# EAGLE design design (EAGLE 9.6.0)
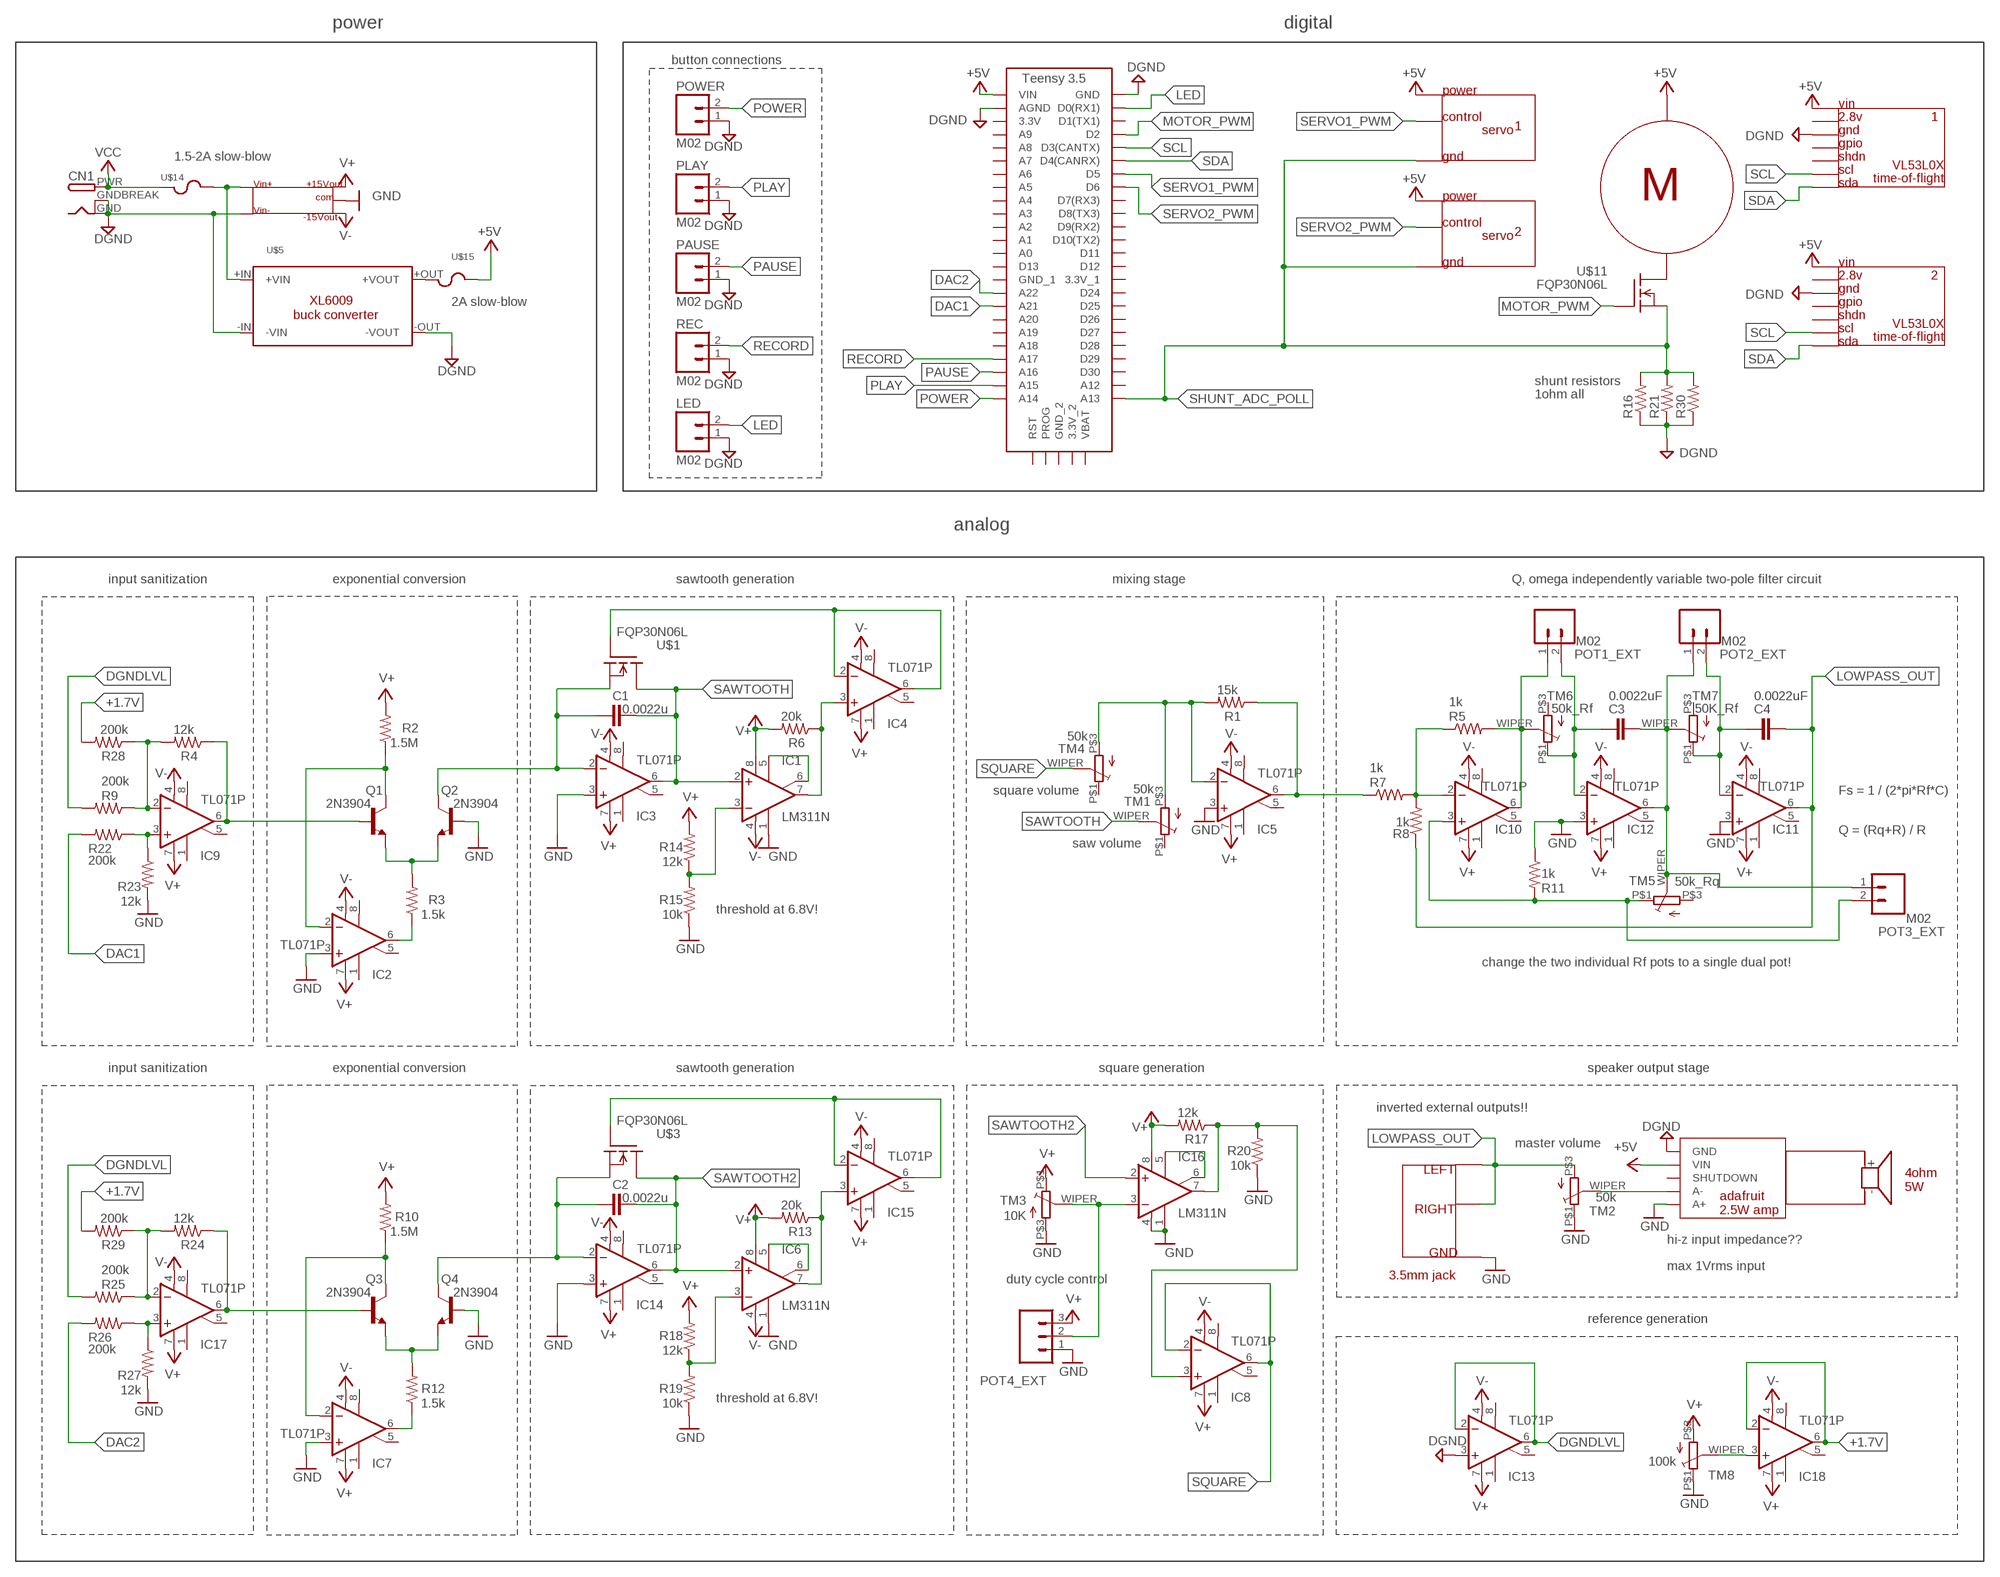
[diagram p0: schematic, sheet 1]

## Parts
C1  0.0022u  CAPPTH1  [CAP-PTH-5MM]
C2  0.0022u  CAPPTH1  [CAP-PTH-5MM]
C3  0.0022uF  CAPPTH1  [CAP-PTH-5MM]
C4  0.0022uF  CAPPTH1  [CAP-PTH-5MM]
CN1  DCBARRELPTH  [DCJACK_2MM_PTH]
IC1  LM311N  [DIL08]
IC2  TL071P  [DIL08]
IC3  TL071P  [DIL08]
IC4  TL071P  [DIL08]
IC5  TL071P  [DIL08]
IC6  LM311N  [DIL08]
IC7  TL071P  [DIL08]
IC8  TL071P  [DIL08]
IC9  TL071P  [DIL08]
IC10  TL071P  [DIL08]
IC11  TL071P  [DIL08]
IC12  TL071P  [DIL08]
IC13  TL071P  [DIL08]
IC14  TL071P  [DIL08]
IC15  TL071P  [DIL08]
IC16  LM311N  [DIL08]
IC17  TL071P  [DIL08]
IC18  TL071P  [DIL08]
LED  M02  [1X02]
PAUSE  M02  [1X02]
PLAY  M02  [1X02]
POT1_EXT  M02  [1X02]
POT2_EXT  M02  [1X02]
POT3_EXT  M02  [1X02]
POT4_EXT  M03  [1X03]
POWER  M02  [1X02]
Q1  2N3904  [TO92]
Q2  2N3904  [TO92]
Q3  2N3904  [TO92]
Q4  2N3904  [TO92]
R1  15k  RESISTORAXIAL-0.3  [AXIAL-0.3]
R2  1.5M  RESISTORAXIAL-0.3  [AXIAL-0.3]
R3  1.5k  RESISTORAXIAL-0.3  [AXIAL-0.3]
R4  12k  RESISTORAXIAL-0.3  [AXIAL-0.3]
R5  1k  RESISTORAXIAL-0.3  [AXIAL-0.3]
R6  20k  RESISTORAXIAL-0.3  [AXIAL-0.3]
R7  1k  RESISTORAXIAL-0.3  [AXIAL-0.3]
R8  1k  RESISTORAXIAL-0.3  [AXIAL-0.3]
R9  200k  RESISTORAXIAL-0.3  [AXIAL-0.3]
R10  1.5M  RESISTORAXIAL-0.3  [AXIAL-0.3]
R11  1k  RESISTORAXIAL-0.3  [AXIAL-0.3]
R12  1.5k  RESISTORAXIAL-0.3  [AXIAL-0.3]
R13  20k  RESISTORAXIAL-0.3  [AXIAL-0.3]
R14  12k  RESISTORAXIAL-0.3  [AXIAL-0.3]
R15  10k  RESISTORAXIAL-0.3  [AXIAL-0.3]
R16  RESISTORAXIAL-0.3  [AXIAL-0.3]
R17  12k  RESISTORAXIAL-0.3  [AXIAL-0.3]
R18  12k  RESISTORAXIAL-0.3  [AXIAL-0.3]
R19  10k  RESISTORAXIAL-0.3  [AXIAL-0.3]
R20  10k  RESISTORAXIAL-0.3  [AXIAL-0.3]
R21  RESISTORAXIAL-0.3  [AXIAL-0.3]
R22  200k  RESISTORAXIAL-0.3  [AXIAL-0.3]
R23  12k  RESISTORAXIAL-0.3  [AXIAL-0.3]
R24  12k  RESISTORAXIAL-0.3  [AXIAL-0.3]
R25  200k  RESISTORAXIAL-0.3  [AXIAL-0.3]
R26  200k  RESISTORAXIAL-0.3  [AXIAL-0.3]
R27  12k  RESISTORAXIAL-0.3  [AXIAL-0.3]
R28  200k  RESISTORAXIAL-0.3  [AXIAL-0.3]
R29  200k  RESISTORAXIAL-0.3  [AXIAL-0.3]
R30  RESISTORAXIAL-0.3  [AXIAL-0.3]
REC  M02  [1X02]
SP1  BUZZER  (no package)
TM1  50k  TRIMPOT  [3386_TRI]
TM2  50k  TRIMPOT  [3386_TRI]
TM3  10K  TRIMPOT  [3386_TRI]
TM4  50k  TRIMPOT  [3386_TRI]
TM5  50k_Rq  TRIMPOT  [3386_TRI]
TM6  50k_Rf  TRIMPOT  [3386_TRI]
TM7  50K_Rf  TRIMPOT  [3386_TRI]
TM8  100k  TRIMPOT  [3386_TRI]
U$1  FQP30N06L  [TO-220]
U$2  PAM8302A_ADAFRUIT  [PAM8302A_ADAFRUIT]
U$3  FQP30N06L  [TO-220]
U$4  TEENSY_3.5_EXT  [TEENSY_3.5_EXT]
U$5  DC/DC-STEP-DOWN-XL6009  [DC/DC-STEP-UP-XL6009]
U$6  3.5MM_AUDIO_JACK  [3.5MM_AUDIO_JACK]
U$7  +/-15V_BOOST_CONVERTER  [+/-15V_BOOST_CONVERTER]
U$8  SERVO_3PIN_HEADER  [SERVO_3PIN_HEADER]
U$9  SERVO_3PIN_HEADER  [SERVO_3PIN_HEADER]
U$10  3872_MOTOR  [3872_MOTOR]
U$11  FQP30N06L  [TO-220]
U$12  VL53L0X  [VL53L0X]
U$13  VL53L0X  [VL53L0X]
U$14  FUSE_5X20MM  [0751.0110]
U$15  FUSE_5X20MM  [0751.0110]

## Nets
+1.7V: IC18.2(-IN) IC18.6(OUT) R28.P$2 R29.P$2
+5V: U$2.VIN U$4.VIN U$8.POWER U$9.POWER U$10.+ U$12.VIN U$13.VIN U$15.R1 U$15.R2
BANDPASS_OUT: C3.1 IC12.6(OUT) POT2_EXT.1 POT3_EXT.1 TM5.WIPER(S) TM7.WIPER(S)
COMP_SQ_OUT: IC8.3(+IN) IC16.7(OUT) R17.P$1 R20.P$2
DAC1: R22.P$2 U$4.A21
DAC2: R26.P$2 U$4.A22
DGND: CN1.GND CN1.GNDBREAK IC13.3(+IN) LED.1 PAUSE.1 PLAY.1 POWER.1 R16.P$1 R21.P$1 R30.P$1 REC.1 U$2.GND U$4.AGND U$4.GND U$5.-IN(-VIN) U$5.-OUT(-VOUT) U$7.1 U$12.GND U$13.GND
DGNDLVL: IC13.2(-IN) IC13.6(OUT) R9.P$2 R25.P$2
GND: IC1.1(GND) IC2.3(+IN) IC3.3(+IN) IC5.3(+IN) IC6.1(GND) IC7.3(+IN) IC11.3(+IN) IC12.3(+IN) IC14.3(+IN) IC16.1(GND) IC16.4(V-) POT4_EXT.1 Q2.2(B) Q4.2(B) R11.P$1 R15.P$1 R19.P$1 R20.P$1 R23.P$2 R27.P$2 TM2.P$1(E) TM3.P$3(A) TM8.P$1(E) U$2.A+ U$6.GND U$7.7
HIGHPASS_OUT: IC10.6(OUT) POT1_EXT.1 R5.P$2 TM6.WIPER(S)
INPUT2: IC5.6(OUT) R1.P$1 R7.P$1
LED: LED.2 U$4.D0(RX1)
LOWPASS_OUT: C4.1 IC11.6(OUT) R8.P$1 TM2.P$3(A) U$6.L U$6.R
MOTOR_PWM: U$4.D2 U$11.1(G)
N$1: TM2.WIPER(S) U$2.A-
N$2: Q1.3(E) Q2.3(E) R3.P$2
N$3: Q3.3(E) Q4.3(E) R12.P$2
N$4: IC18.3(+IN) TM8.WIPER(S)
N$5: IC2.6(OUT) R3.P$1
N$6: IC1.7(OUT) IC4.3(+IN) R6.P$1
N$7: C1.1 IC3.2(-IN) Q2.1(C) U$1.3(S)
N$8: IC6.7(OUT) IC15.3(+IN) R13.P$1
N$9: IC1.5(ON) IC1.6(ON/STR)
N$10: IC4.2(-IN) IC4.6(OUT) U$1.1(G)
N$11: IC17.3(+IN) R26.P$1 R27.P$1
N$12: IC2.2(-IN) Q1.1(C) R2.P$1
N$13: IC7.6(OUT) R12.P$1
N$14: C2.1 IC14.2(-IN) Q4.1(C) U$3.3(S)
N$15: IC6.5(ON) IC6.6(ON/STR)
N$16: IC15.2(-IN) IC15.6(OUT) U$3.1(G)
N$17: IC16.5(ON) IC16.6(ON/STR)
N$18: IC10.2(-IN) R5.P$1 R7.P$2 R8.P$2
N$19: IC17.6(OUT) Q3.2(B) R24.P$1
N$20: C3.2 IC12.2(-IN) POT1_EXT.2 TM6.P$1(E)
N$21: IC7.2(-IN) Q3.1(C) R10.P$1
N$22: C4.2 IC11.2(-IN) POT2_EXT.2 TM7.P$1(E)
N$23: IC6.3(-IN) R18.P$1 R19.P$2
N$24: IC1.3(-IN) R14.P$1 R15.P$2
N$25: IC10.3(+IN) POT3_EXT.2 R11.P$2 TM5.P$1(E)
N$26: IC16.3(-IN) POT4_EXT.2 TM3.WIPER(S)
N$27: IC17.2(-IN) R24.P$2 R25.P$1 R29.P$1
N$28: IC5.2(-IN) R1.P$2 TM1.P$3(A) TM4.P$3(A)
N$29: U$5.+IN(+VIN) U$7.2 U$14.R1 U$14.R2
N$30: IC9.2(-IN) R4.P$2 R9.P$1 R28.P$1
N$31: IC9.3(+IN) R22.P$1 R23.P$1
N$32: U$5.+OUT(+VOUT) U$15.L1 U$15.L2
N$33: U$10.- U$11.2(D)
PAUSE: PAUSE.2 U$4.A16
PLAY: PLAY.2 U$4.A15
POWER: POWER.2 U$4.A14
RECORD: REC.2 U$4.A17
SAWTOOTH: C1.2 IC1.2(+IN) IC3.6(OUT) TM1.WIPER(S) U$1.2(D)
SAWTOOTH2: C2.2 IC6.2(+IN) IC14.6(OUT) IC16.2(+IN) U$3.2(D)
SCL: U$4.D3(CANTX) U$12.SCL U$13.SCL
SDA: U$4.D4(CANRX) U$12.SDA U$13.SDA
SERVO1_PWM: U$4.D5 U$8.CONTROL
SERVO2_PWM: U$4.D6 U$9.CONTROL
SHUNT_ADC_POLL: R16.P$2 R21.P$2 R30.P$2 U$4.A13 U$8.GND U$9.GND U$11.3(S)
SIGNAL1: IC9.6(OUT) Q1.2(B) R4.P$1
SQUARE: IC8.2(-IN) IC8.6(OUT) TM4.WIPER(S)
V+: IC1.8(V+) IC2.7(V+) IC3.7(V+) IC4.7(V+) IC5.7(V+) IC6.8(V+) IC7.7(V+) IC8.7(V+) IC9.7(V+) IC10.7(V+) IC11.7(V+) IC12.7(V+) IC13.7(V+) IC14.7(V+) IC15.7(V+) IC16.8(V+) IC17.7(V+) IC18.7(V+) POT4_EXT.3 R2.P$2 R6.P$2 R10.P$2 R13.P$2 R14.P$2 R17.P$2 R18.P$2 TM3.P$1(E) TM8.P$3(A) U$7.6
V-: IC1.4(V-) IC2.4(V-) IC3.4(V-) IC4.4(V-) IC5.4(V-) IC6.4(V-) IC7.4(V-) IC8.4(V-) IC9.4(V-) IC10.4(V-) IC11.4(V-) IC12.4(V-) IC13.4(V-) IC14.4(V-) IC15.4(V-) IC17.4(V-) IC18.4(V-) U$7.8
VCC: CN1.PWR U$14.L1 U$14.L2
Unconnected: IC2.1(ON1) IC2.5(ON2) IC2.8(OPT) IC3.1(ON1) IC3.5(ON2) IC3.8(OPT) IC4.1(ON1) IC4.5(ON2) IC4.8(OPT) IC5.1(ON1) IC5.5(ON2) IC5.8(OPT) IC7.1(ON1) IC7.5(ON2) IC7.8(OPT) IC8.1(ON1) IC8.5(ON2) IC8.8(OPT) IC9.1(ON1) IC9.5(ON2) IC9.8(OPT) IC10.1(ON1) IC10.5(ON2) IC10.8(OPT) IC11.1(ON1) IC11.5(ON2) IC11.8(OPT) IC12.1(ON1) IC12.5(ON2) IC12.8(OPT) IC13.1(ON1) IC13.5(ON2) IC13.8(OPT) IC14.1(ON1) IC14.5(ON2) IC14.8(OPT) IC15.1(ON1) IC15.5(ON2) IC15.8(OPT) IC17.1(ON1) IC17.5(ON2) IC17.8(OPT) IC18.1(ON1) IC18.5(ON2) IC18.8(OPT) SP1.1 SP1.2 TM1.P$1(E) TM4.P$1(E) TM5.P$3(A) TM6.P$3(A) TM7.P$3(A) U$2.SD(SHUTDOWN) U$4.3.3V U$4.3.3V_1 U$4.3.3V_2 U$4.A0 U$4.A1 U$4.A2 U$4.A3 U$4.A4 U$4.A5 U$4.A6 U$4.A7 U$4.A8 U$4.A9 U$4.A12 U$4.A18 U$4.A19 U$4.A20 U$4.D1(TX1) U$4.D7(RX3) U$4.D8(TX3) U$4.D9(RX2) U$4.D10(TX2) U$4.D11 U$4.D12 U$4.D13 U$4.D24 U$4.D25 U$4.D26 U$4.D27 U$4.D28 U$4.D29 U$4.D30 U$4.GND_1 U$4.GND_2 U$4.PROG U$4.RST U$4.VBAT U$12.2.8V U$12.GPIO U$12.SHDN U$13.2.8V U$13.GPIO U$13.SHDN

## Notes on the sheet
- power | digital
- button connections
- 1 | 1
- 1.5-2A slow-blow
- 2
- 2
- 2A slow-blow
- shunt resistors
- 1ohm all
- analog
- input sanitization | exponential conversion | sawtooth generation | mixing stage | Q, omega independently variable two-pole filter circuit
- square volume | Fs = 1 / (2*pi*Rf*C)
- Q = (Rq+R) / R
- saw volume
- threshold at 6.8V!
- change the two individual Rf pots to a single dual pot!
- input sanitization | exponential conversion | sawtooth generation | square generation | speaker output stage
- inverted external outputs!!
- master volume
- 4ohm
  5W
- hi-z input impedance??
- 3.5mm jack | max 1Vrms input
- duty cycle control
- reference generation
- threshold at 6.8V!

## Library data of the parts
C1-C4 = HyTechDevices:CAP: Capacitor Standard 0603 ceramic capacitor, and 0.1" leaded capacitor.
CN1 = HyTechDevices:DCBARREL: 2.0mm DC Barrel Jack DCJACK_2MM_PTH - Through Hole Jack (4UConnector: 05537) Source: Adafruit <https://github.com/adafruit/Adafruit-Eagle-Library>
IC1 IC6 IC16 = linear:LM311: COMPARATOR
IC2-IC5 IC7-IC15 IC17 IC18 = linear:TL071: OP AMP
LED PAUSE PLAY POT1_EXT POT2_EXT POT3_EXT POWER REC = HyTechDevices:M02: Standard 2-pin 0.1" header. NOTES ON THE VARIANTS LOCK and LOCK_LONGPADS... This footprint was designed to help hold the alignment of a through-hole component (i.e. 6-pin header) while soldering it into place. You may notice that each hole has been shifted either up or down by 0.005 of an inch from it's more standard position (which is a perfectly straight line). This slight alteration caused the pins (the squares in the middle) to touch the edges of the holes. Because they are alternating, it causes a "brace" to hold the component in place. 0.005 has proven to be the perfect amount of "off-center" position when using our standard breakaway headers. Although looks a little odd when you look at the bare footprint, once you have a header in there, the alteration is very hard to notice. Also,if you push a header all the way into place, it is covered up entirely on the bottom side. This idea of altering the position of holes to aid alignment will be further integrated into the Sparkfun Library for other footprints. It can help hold any component with 3 or more connection pins. Note: The Sparkfun version includes many other packages including surface mount that may be of future interest. Source: Sparkfun <https://github.com/sparkfun/SparkFun-Eagle-Libraries>
POT4_EXT = HyTechDevices:M03: Standard 3-pin 0.1" header.
Q1-Q4 = transistor:2N3904: NPN TRANSISTOR
R1-R30 = HyTechDevices:RESISTOR: Resistor Basic schematic elements and footprints for 0603, 1206, and PTH resistors.
SP1 = HyTechSymbols:BUZZER: SPEAKER Prouct Page <http://www.alliedelec.com/icc-intervox-brp4535s-12-c/70115826/> (Ready to Drive Sound) Source: Schukat
TM1-TM8 = HyTechDevices:TRIMPOT: SMT trimmer potentiometer part number TC33X http://www.ladyada.net/library/eagle
U$1 U$3 U$11 = HyTechDevices:FQP30N06L
U$2 = HyTechDevices:PAM8302A_ADAFRUIT
U$4 = HyTechDevices:TEENSY_3.5_EXT: Simple version of the Teensy 3.5 board that only uses the 2 main rows of pins, plus the perpendicular row with VBat.
U$5 = userlib:DC/DC-STEP-DOWN-XL6009
U$6 = userlib:3.5MM_AUDIO_JACK
U$7 = userlib:+/-15V_BOOST_CONVERTER
U$8 U$9 = HyTechDevices:SERVO_3PIN_HEADER
U$10 = HyTechDevices:3872_MOTOR
U$12 U$13 = HyTechDevices:VL53L0X
U$14 U$15 = HyTechDevices:FUSE: Fuse/Fuseclips Keystone Electronics 3568 Fuse Mouser Part <http://www.mouser.com/ProductDetail/Keystone-Electronics/3568> Datasheet <http://www.mouser.com/ds/2/215/568-742601.pdf> Bussman/Eaton Midget Fuse Clip 1A3400 <http://www.mouser.com/ProductDetail/Bussmann-Eaton/BK-1A3400-09-R/?qs=sGAEpiMZZMuG%252bgnN5hGYGzzlAelq2OxnKqVSMVjq8I4%3d> Schurter 0751.0110 Brass Fuse Clip Datasheet <http://www.mouser.com/ds/2/358/typ_OG__Clip__5x20-2553.pdf>

## Board
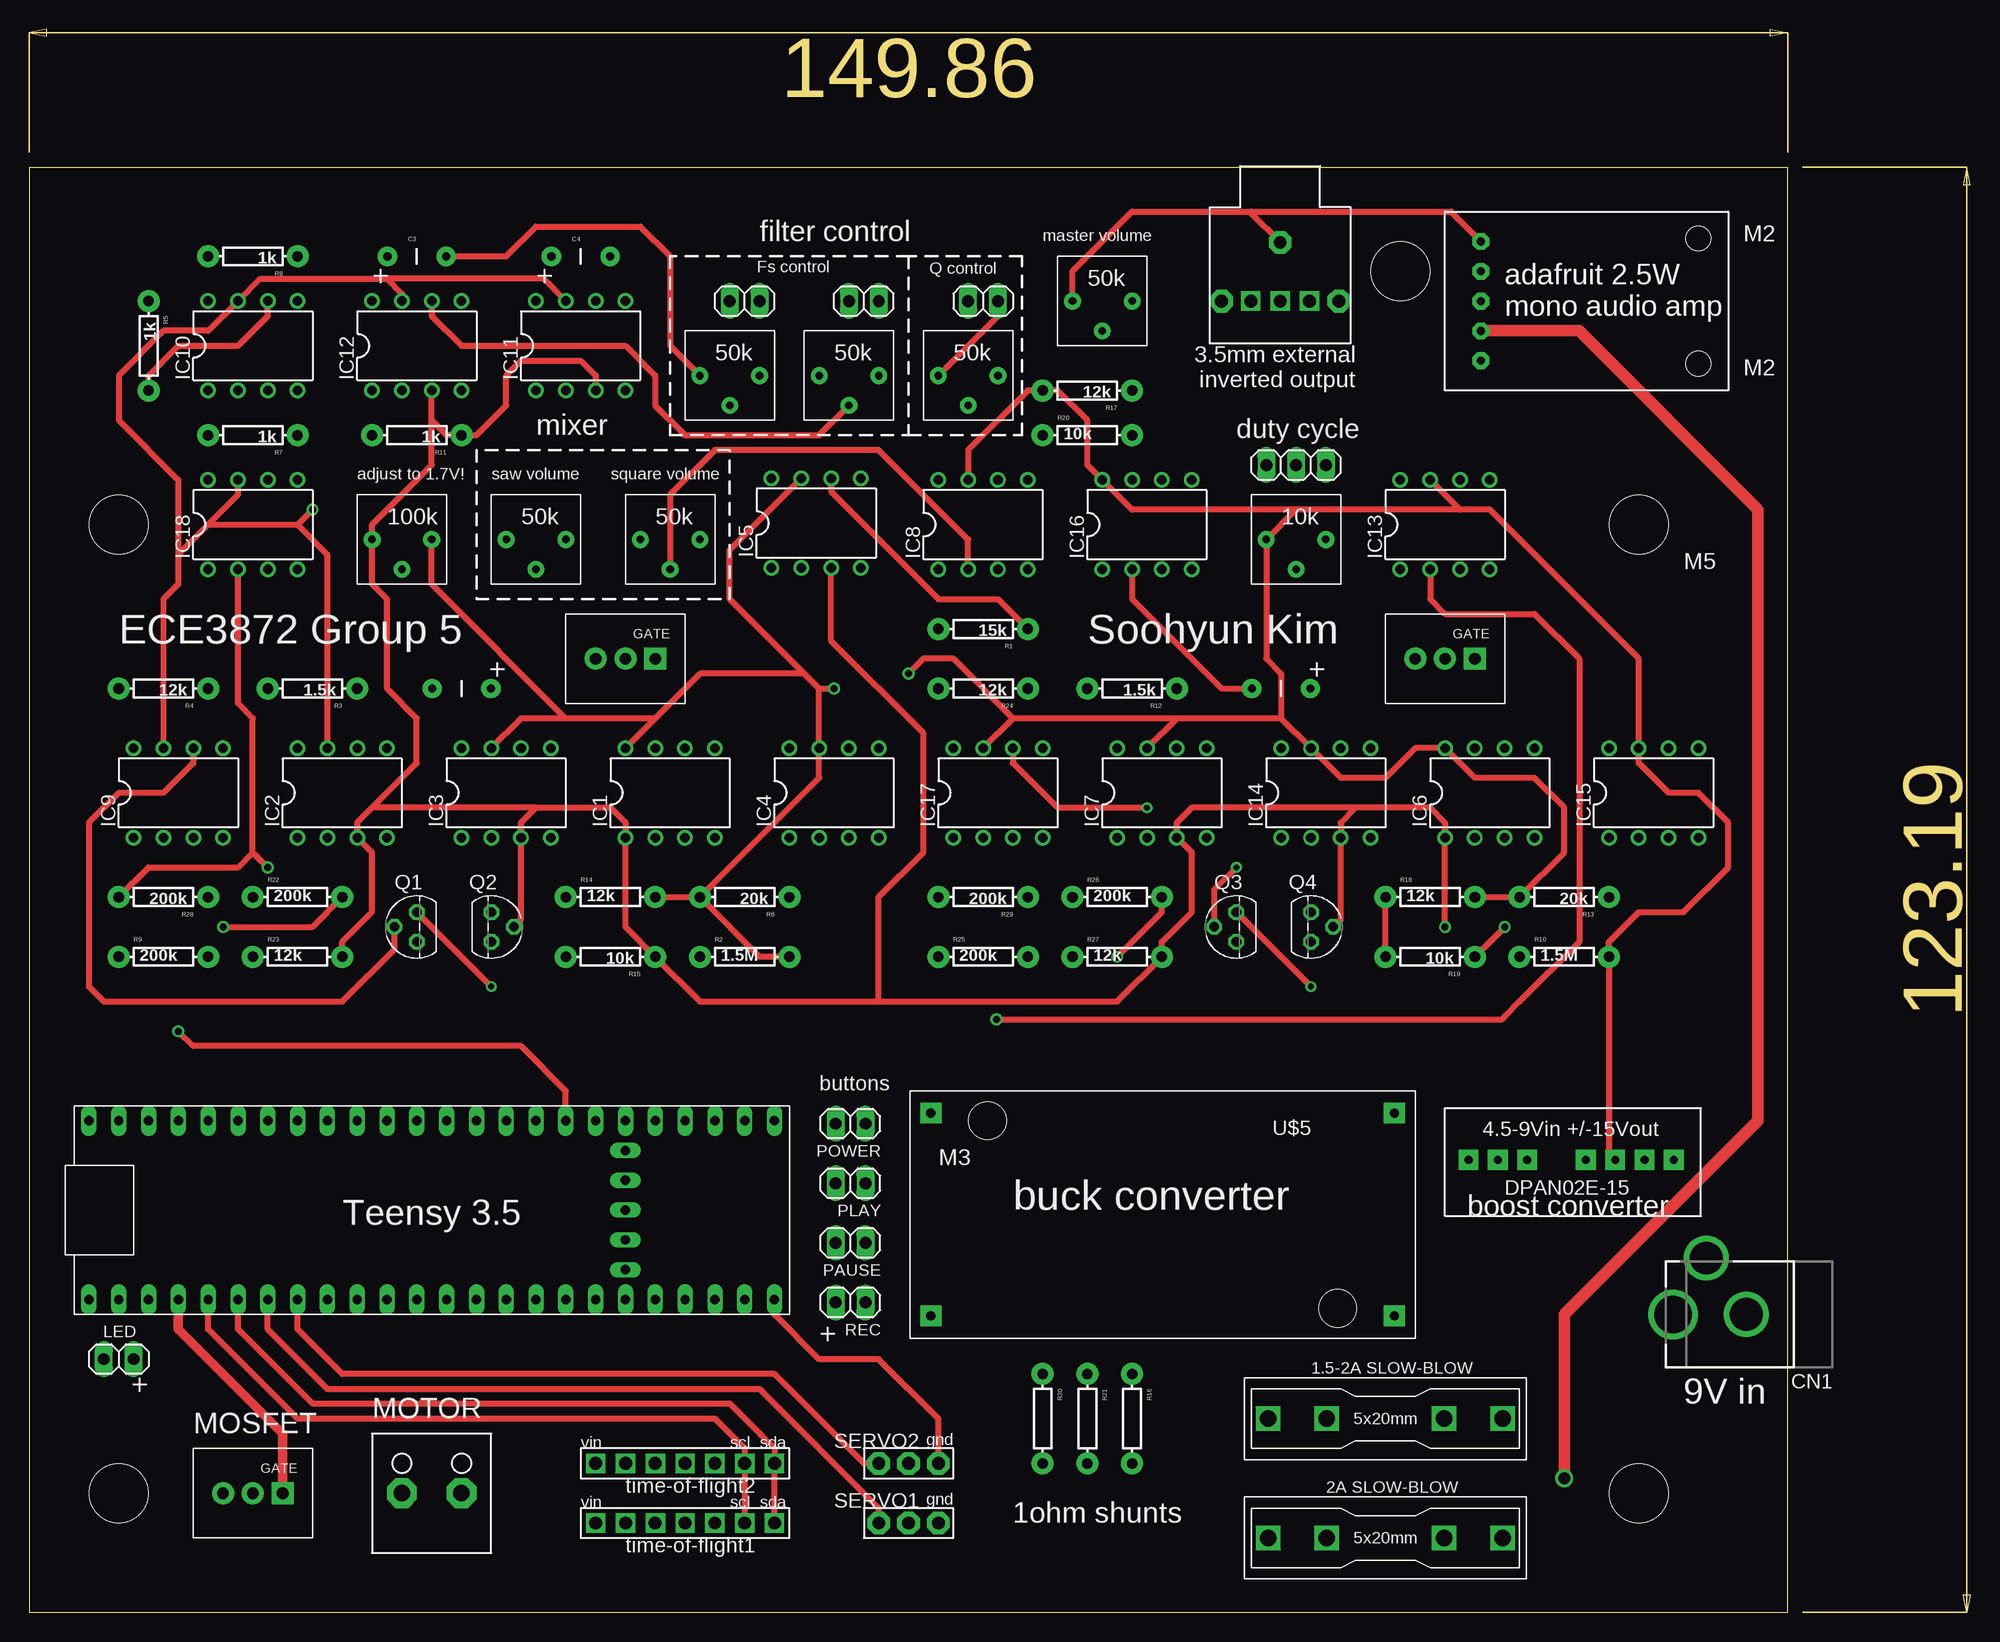
[diagram p1: board, top side]
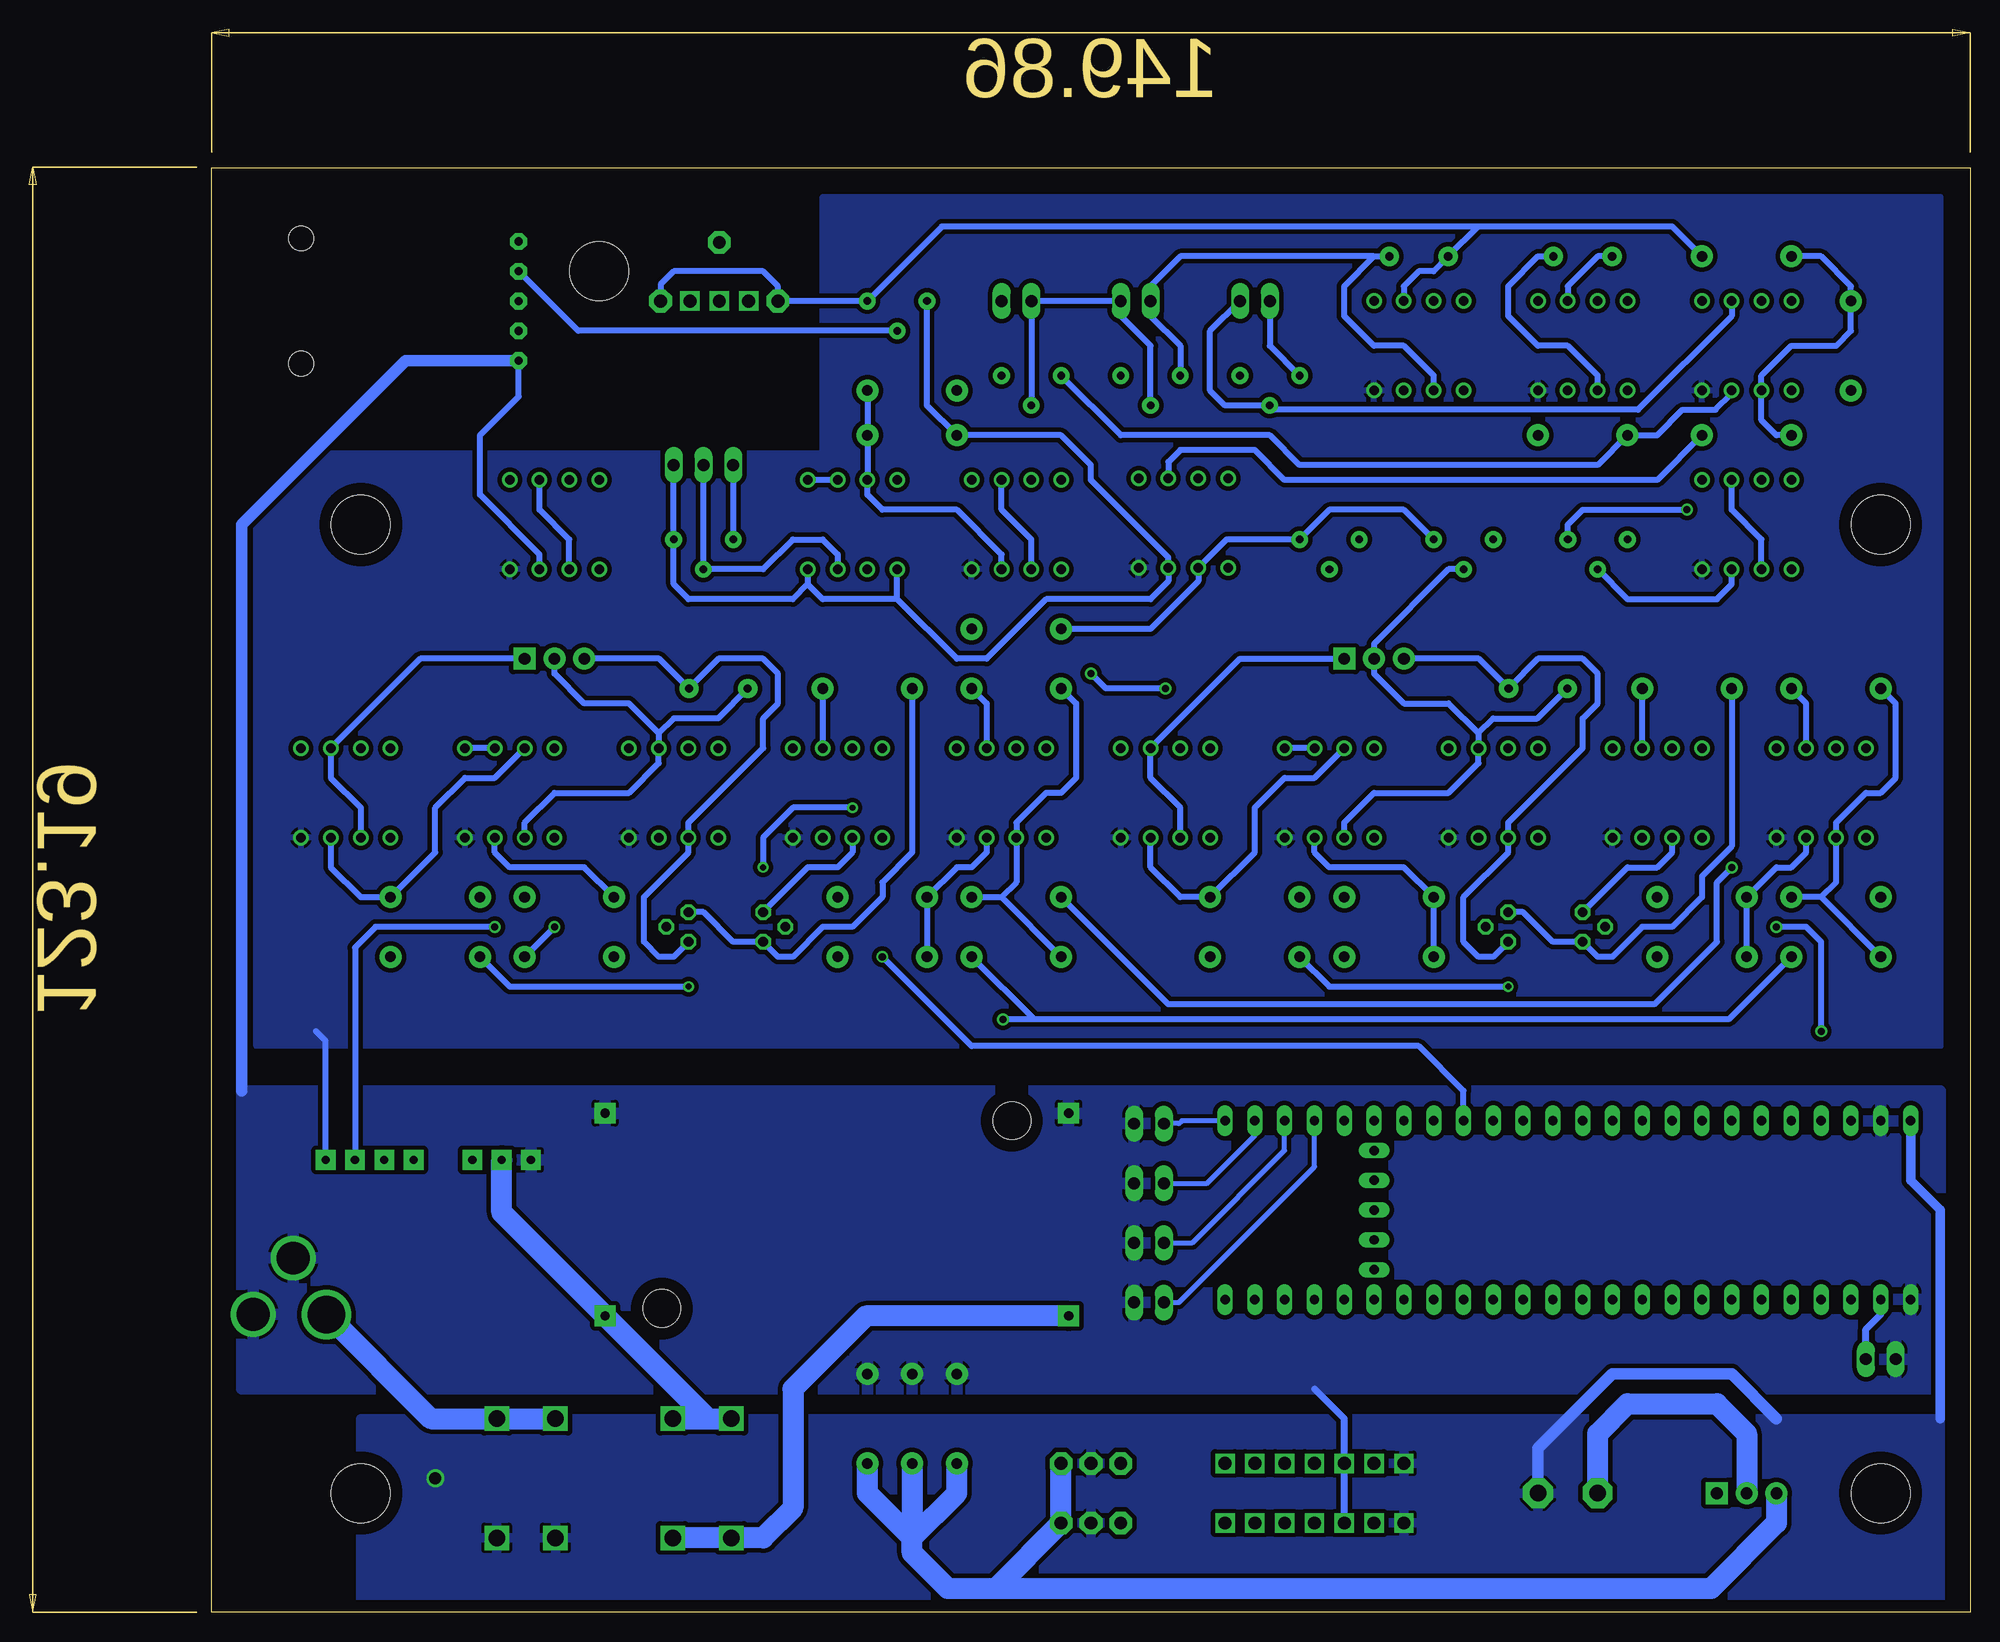
[diagram p2: board, bottom side, seen from below]

Size 149.84 x 123.11 mm. Coordinates in mm from the lower left corner, seen from the top.
Outline: 0,0 149.84,0 149.84,123.11 0,123.11 0,0
Copper layers (1*16): Top 0.035mm / dielectric 1.5mm / Bottom 0.035mm
Design rules "default *": minimum track width 6mil, minimum drill 0.35mm, track to track 15mil, track to pad 15mil, pad to pad 15mil, via to via 15mil, smd to smd 6mil, copper to edge 40mil, drill to drill 6mil, minimum pad ring 10mil, minimum via ring 8mil, stop-mask expansion 4mil, vias tented up to drill 0mil, thermal gap 10mil
Holes 5 mm at 7.62,92.71 137.16,92.71 116.84,114.3 7.62,10.16 137.16,10.16

### Footprints (pad centres in the part's own frame; a part is rotated, then mirrored left to right if it is on the bottom)
CAP-PTH-5MM = drill 0.7 pad 1.651: 1 -2.5,0; 2 2.5,0
DCJACK_2MM_PTH = drill 2.8: GND 0,7.35; GNDBREAK 4.8,10.75 | drill 3.2: PWR 0,13.6
DIL08 = drill 0.813 pad 1.27: 1 -3.81,-3.81; 2 -1.27,-3.81; 3 1.27,-3.81; 4 3.81,-3.81; 5 3.81,3.81; 6 1.27,3.81; 7 -1.27,3.81; 8 -3.81,3.81
1X02 = drill 1.016 long: 1 -1.27,0; 2 1.27,0
1X03 = drill 1.016 long: 1 -2.54,0; 2 0,0; 3 2.54,0
TO92 = drill 0.813 octagon: 1 1.27,0; 2 0,1.905; 3 -1.27,0
AXIAL-0.3 = drill 0.9 pad 1.88: P$1 -3.81,0; P$2 3.81,0
3386_TRI = drill 0.65 pad 1.422: P$1 1.27,-1.27; P$3 6.35,-1.27; WIPER 3.81,-3.81
TO-220 = drill 1 pad 1.88 square: 1 -2.54,0 | drill 1 pad 1.88: 2 0,0; 3 2.54,0
PAM8302A_ADAFRUIT = drill 0.7 pad 1.422 octagon: A+ 3.05,12.7; A- 3.05,10.16; GND 3.05,2.54; SD 3.05,7.62; VIN 3.05,5.08 | hole 2.1: 21.59,2.286; 21.59,12.954
TEENSY_3.5_EXT = drill 0.8 long: 3.3V 16.51,54.61; 3.3V_1 1.27,24.13; 3.3V_2 6.35,13.97; A0 16.51,29.21; A1 16.51,31.75; A2 16.51,34.29; A3 16.51,36.83; A4 16.51,39.37; A5 16.51,41.91; A6 16.51,44.45; A7 16.51,46.99; A8 16.51,49.53; A9 16.51,52.07; A12 1.27,3.81; A13 1.27,1.27; A14 16.51,1.27; A15 16.51,3.81; A16 16.51,6.35; A17 16.51,8.89; A18 16.51,11.43; A19 16.51,13.97; A20 16.51,16.51; A21 16.51,19.05; A22 16.51,21.59; AGND 16.51,57.15; D0(RX1) 1.27,57.15; D1(TX1) 1.27,54.61; D2 1.27,52.07; D3(CANTX) 1.27,49.53; D4(CANRX) 1.27,46.99; D5 1.27,44.45; D6 1.27,41.91; D7(RX3) 1.27,39.37; D8(TX3) 1.27,36.83; D9(RX2) 1.27,34.29; D10(TX2) 1.27,31.75; D11 1.27,29.21; D12 1.27,26.67; D13 16.51,26.67; D24 1.27,21.59; D25 1.27,19.05; D26 1.27,16.51; D27 1.27,13.97; D28 1.27,11.43; D29 1.27,8.89; D30 1.27,6.35; GND 1.27,59.69; GND_1 16.51,24.13; GND_2 8.89,13.97; PROG 11.43,13.97; RST 13.97,13.97; VBAT 3.81,13.97; VIN 16.51,59.69
DC/DC-STEP-UP-XL6009 = drill 0.8 pad 1.778 square: +IN 1.778,19.177; +OUT 41.275,19.177; -IN 1.778,1.905; -OUT 41.275,1.905 | hole 3.2: 6.604,18.542; 36.449,2.54
3.5MM_AUDIO_JACK = drill 1.1 pad 1.93 octagon: GND -5,5; L 0,0; R 0,10 | drill 1.1 pad 1.27 square: P$1 0,7.5; P$2 0,5; P$3 0,2.5
+/-15V_BOOST_CONVERTER = drill 0.7 pad 1.676 square: 1 2,3; 2 4.5,3; 3 7,3; 5 12,3; 6 14.5,3; 7 17,3; 8 19.5,3
SERVO_3PIN_HEADER = drill 1.1 pad 1.93 octagon: CONTROL 0,0; GND 5.08,0; POWER 2.54,0
3872_MOTOR = drill 1.4 pad 2.54 octagon: + 2.54,2.54; - 7.62,2.54
VL53L0X = drill 1.1 square: 2.8V 3.81,1.27; GND 6.35,1.27; GPIO 8.89,1.27; SCL 13.97,1.27; SDA 16.51,1.27; SHDN 11.43,1.27; VIN 1.27,1.27
0751.0110 = drill 1.4 square: L1 -10,0; L2 -5,0; R1 5,0; R2 10,0

### Placement (x,y rotation side)
C1  36.83,78.74 180 top
C2  106.68,78.74 180 top
C3  33.02,115.57 0 top
C4  46.99,115.57 0 top
CN1  153.67,25.4 90 top
IC1  54.61,69.85 0 top
IC2  26.67,69.85 0 top
IC3  40.64,69.85 0 top
IC4  68.58,69.85 0 top
IC5  67.06,92.84 0 top
IC6  124.46,69.85 0 top
IC7  96.52,69.85 0 top
IC8  81.28,92.71 0 top
IC9  12.7,69.85 0 top
IC10  19.05,107.95 0 top
IC11  46.99,107.95 0 top
IC12  33.02,107.95 0 top
IC13  120.65,92.71 0 top
IC14  110.49,69.85 0 top
IC15  138.43,69.85 0 top
IC16  95.25,92.71 0 top
IC17  82.55,69.85 0 top
IC18  19.05,92.71 0 top
LED  7.62,21.59 0 top
PAUSE  69.98,31.5 180 top
PLAY  69.98,36.58 180 top
POT1_EXT  60.96,111.76 180 top
POT2_EXT  71.12,111.76 180 top
POT3_EXT  81.28,111.76 0 top
POT4_EXT  107.95,97.79 180 top
POWER  69.98,41.66 180 top
Q1  33.02,58.42 90 top
Q2  39.37,58.42 270 top
Q3  102.87,58.42 90 top
Q4  109.22,58.42 270 top
R1  81.28,83.82 180 top
R2  60.96,55.88 0 top
R3  24.13,78.74 180 top
R4  11.43,78.74 180 top
R5  10.16,107.95 270 top
R6  60.96,60.96 180 top
R7  19.05,100.33 180 top
R8  19.05,115.57 180 top
R9  11.43,55.88 0 top
R10  130.81,55.88 0 top
R11  33.02,100.33 180 top
R12  93.98,78.74 180 top
R13  130.81,60.96 180 top
R14  49.53,60.96 0 top
R15  49.53,55.88 180 top
R16  93.98,16.51 270 top
R17  90.17,104.14 180 top
R18  119.38,60.96 0 top
R19  119.38,55.88 180 top
R20  90.17,100.33 0 top
R21  90.17,16.51 270 top
R22  22.86,60.96 0 top
R23  22.86,55.88 0 top
R24  81.28,78.74 180 top
R25  81.28,55.88 0 top
R26  92.71,60.96 0 top
R27  92.71,55.88 0 top
R28  11.43,60.96 180 top
R29  81.28,60.96 180 top
R30  86.36,16.51 270 top
REC  69.98,26.42 180 top
TM1  39.37,92.71 0 top
TM2  87.63,113.03 0 top
TM3  104.14,92.71 0 top
TM4  50.8,92.71 0 top
TM5  76.2,106.68 0 top
TM6  55.88,106.68 0 top
TM7  66.04,106.68 0 top
TM8  27.94,92.71 0 top
U$1  50.8,81.28 180 top
U$2  120.65,104.14 0 top
U$3  120.65,81.28 180 top
U$4  64.77,25.4 90 top
U$5  118.11,44.45 180 top
U$6  101.6,111.76 270 top
U$7  120.65,35.56 0 top
U$8  72.39,7.62 0 top
U$9  72.39,12.7 0 top
U$10  39.37,12.7 180 top
U$11  19.05,10.16 180 top
U$12  46.99,6.35 0 top
U$13  46.99,11.43 0 top
U$14  115.57,16.51 180 top
U$15  115.57,6.35 0 top

### Tracks (layer width: path | path; a pad name or v marks a point on that pad's centre or on a via)
+1.7V  (via drill 0.6)
  Top 0.508: R28.P$2 10.16,63.5 17.78,63.5 19.05,64.77 | IC18.2 17.78,77.47 19.05,76.2 19.05,64.77 | v20.32,63.5 19.05,64.77
  Bottom 0.508: IC18.2 17.78,91.44 20.32,93.98 IC18.6 | R29.P$2 68.33,51.82 26.92,51.82 21.59,57.15 21.59,62.23 v20.32,63.5
+5V  (via drill 1)
  Top 1: U$2.VIN 132.08,109.22 147.32,93.98 147.32,41.91 130.81,25.4 v130.81,11.43
  Bottom 0.813: U$4.VIN 5.08,36.83 2.54,34.29 2.54,16.51
  Bottom 1: U$10.+ 36.83,13.97 30.48,20.32 20.32,20.32 16.51,16.51
  pour Bottom: 137.16,0 137.16,16.51 2.54,16.51 2.54,0
BANDPASS_OUT
  Top 0.508: IC12.6 34.29,110.49 36.83,107.95 50.8,107.95 53.34,105.41 53.34,102.87 55.88,100.33 67.31,100.33 TM7.WIPER
  Bottom 0.508: C3.1 31.75,115.57 34.29,113.03 IC12.6 | TM7.WIPER 69.85,107.95 72.39,110.49 POT2_EXT.1 POT3_EXT.1 TM5.WIPER
COMP_SQ_OUT
  Bottom 0.508: IC8.3 82.55,90.17 86.36,93.98 92.71,93.98 93.98,95.25 IC16.7 R20.P$2 R17.P$1
DAC1  (via drill 0.6)
  Top 0.508: U$4.A21 45.72,44.45 41.91,48.26 13.97,48.26 v12.7,49.53 | v16.51,58.42 24.13,58.42 R22.P$2
  Bottom 0.508: v12.7,49.53 12.7,57.15 13.97,58.42 v16.51,58.42
DAC2  (via drill 0.6)
  Top 0.508: v92.71,55.88 96.52,59.69 R26.P$2
  Bottom 0.508: U$4.A22 43.18,44.45 46.99,48.26 85.09,48.26 v92.71,55.88
DGND
  Bottom 0.508: IC13.3 121.92,90.17 127,95.25 127,100.33 123.7,103.63 U$2.GND
  Bottom 0.61: U$12.GND U$13.GND 53.34,16.51 55.88,19.05
  Bottom 1: U$2.GND 133.35,106.68 147.32,92.71 147.32,44.45
  pour Bottom: 2.54,44.45 147.32,44.45 147.32,19.05 2.54,19.05
DGNDLVL  (via drill 0.6)
  Top 0.508: IC13.2 119.38,86.36 120.65,85.09 128.27,85.09 132.08,81.28 132.08,57.15 127,52.07 125.73,50.8 125.48,50.55 v82.42,50.55
  Bottom 0.508: R9.P$2 20.57,50.55 79.76,50.55 | 79.76,50.55 R25.P$2 | IC13.2 119.38,91.44 121.92,93.98 IC13.6 | 79.76,50.55 v82.42,50.55
GND  (via drill 0.6)
  Top 0.508: R23.P$2 26.67,57.15 29.21,59.69 29.21,64.77 IC2.3 27.94,67.31 29.21,68.58 | v120.65,58.42 IC6.1 120.65,67.31 119.38,68.58 113.03,68.58 | 72.39,52.07 57.15,52.07 R15.P$1 50.8,58.42 IC1.1 50.8,67.31 49.53,68.58 43.18,68.58 | 72.39,52.07 92.71,52.07 R27.P$2 96.52,57.15 99.06,59.69 99.06,64.77 IC7.3 97.79,67.31 99.06,68.58 113.03,68.58 | 43.18,68.58 41.91,67.31 IC3.3 41.91,59.06 Q2.2 | 113.03,68.58 111.76,67.31 IC14.3 111.76,59.06 Q4.2 | 72.39,52.07 72.39,60.96 76.2,64.77 76.2,74.93 68.33,82.8 IC5.3 | 29.21,68.58 33.02,72.39 33.02,76.2 30.48,78.74 30.48,86.36 29.21,87.63 TM8.P$1 29.21,92.71 34.29,97.79 34.29,101.6 | 34.29,101.6 IC12.3 | 34.29,101.6 35.56,100.33 R11.P$1 38.1,100.33 40.64,102.87 40.64,105.41 41.91,106.68 46.99,106.68 48.26,105.41 IC11.3 | TM2.P$1 88.9,114.3 93.98,119.38 104.14,119.38 | U$2.A+ 121.16,119.38 104.14,119.38 | v125.73,58.42 R19.P$1 | 43.18,68.58 29.21,68.58 | U$6.GND 104.14,119.22 104.14,119.38
  Bottom 0.508: R19.P$1 v120.65,58.42 | 91.44,86.36 86.36,81.28 83.82,81.28 78.74,86.36 69.85,86.36 68.33,87.88 IC5.3 68.33,89.92 74.93,96.52 74.93,97.79 77.47,100.33 R20.P$1 88.9,102.87 TM2.P$1 | 91.44,86.36 IC16.1 | 99.06,87.63 97.79,86.36 91.44,86.36 | IC16.4 99.06,87.63 | 99.06,87.63 100.33,86.36 109.22,86.36 110.49,87.63 TM3.P$3 POT4_EXT.1 | v125.73,58.42 135.89,58.42 137.65,56.66 U$7.7
HIGHPASS_OUT
  Top 0.508: R5.P$2 10.16,105.41 12.7,107.95 17.78,107.95 20.32,110.49 IC10.6
  Bottom 0.508: IC10.6 20.32,110.49 28.32,102.49 59.31,102.49 TM6.WIPER 63.5,102.87 64.77,104.14 64.77,109.22 POT1_EXT.1
INPUT2
  Top 0.508: IC5.6 68.33,95.5 77.47,86.36 82.55,86.36 R1.P$1
  Bottom 0.508: R7.P$1 26.67,96.52 58.42,96.52 60.96,99.06 67.31,99.06 68.33,98.04 IC5.6
LED
  Bottom 0.61: LED.2 8.89,24.13 7.62,25.4 U$4.D0(RX1)
LOWPASS_OUT
  Bottom 0.508: R8.P$1 25.4,118.11 41.95,118.11 | 41.95,118.11 C4.1 44.49,115.53 45.72,114.3 46.99,114.3 48.26,113.03 IC11.6 | 41.95,118.11 87.63,118.11 TM2.P$3 U$6.L 101.6,113.03 102.87,114.3 110.49,114.3 111.6,113.19 U$6.R
MOTOR_PWM
  Top 0.813: U$4.D2 12.7,24.13 21.59,15.24 U$11.1
N$1
  Bottom 0.508: TM2.WIPER 118.62,109.22 U$2.A-
N$2
  Bottom 0.508: Q2.3 38.1,59.69 35.56,57.15 Q1.3 31.75,55.88 30.48,55.88 27.94,58.42 25.4,58.42 22.86,60.96 22.86,62.74 20.32,65.28 R3.P$2
N$3
  Bottom 0.508: R12.P$2 90.17,64.77 92.71,62.23 92.71,60.96 95.25,58.42 97.79,58.42 100.33,55.88 101.6,55.88 Q3.3 105.41,57.15 107.95,59.69 Q4.3
N$4
  Bottom 0.508: TM8.WIPER 29.21,86.36 21.59,86.36 20.32,87.63 IC18.3
N$5
  Bottom 0.508: IC2.6 R3.P$1
N$6
  Bottom 0.508: IC4.3 69.85,63.5 67.31,60.96 R6.P$1 60.96,64.77 60.96,68.58 58.42,71.12 55.88,71.12 IC1.7
N$7
  Bottom 0.508: Q2.1 40.64,55.88 41.91,55.88 43.18,57.15 43.18,60.96 39.37,64.77 IC3.2 39.37,67.31 33.02,73.66 33.02,76.2 31.75,77.47 31.75,80.01 33.02,81.28 36.83,81.28 39.33,78.78 C1.1 41.87,81.28 U$1.3
N$8
  Bottom 0.508: IC15.3 139.7,63.5 137.16,60.96 R13.P$1 130.81,64.77 130.81,68.58 128.27,71.12 125.73,71.12 IC6.7
N$9
  Bottom 0.508: IC1.6 IC1.5
N$10
  Bottom 0.508: IC4.2 67.31,68.58 69.85,71.12 IC4.6 62.23,81.28 U$1.1
N$11
  Bottom 0.508: IC17.3 83.82,64.77 85.09,63.5 86.36,63.5 R26.P$1 R27.P$1
N$12  (via drill 0.5)
  Top 0.508: v39.37,53.34 Q1.1
  Bottom 0.508: Q1.1 29.21,63.5 26.67,63.5 25.4,64.77 IC2.2 | R2.P$1 54.61,53.34 v39.37,53.34
N$13
  Bottom 0.508: R12.P$1 IC7.6
N$14
  Bottom 0.508: Q4.1 110.49,55.88 111.76,55.88 113.03,57.15 113.03,60.96 109.22,64.77 IC14.2 109.22,67.31 102.87,73.66 102.87,76.2 101.6,77.47 101.6,80.01 102.87,81.28 106.68,81.28 109.18,78.78 C2.1 111.72,81.28 U$3.3
N$15
  Bottom 0.508: IC6.6 IC6.5
N$16
  Bottom 0.508: U$3.1 132.08,81.28 IC15.6 139.7,71.12 137.16,68.58 IC15.2
N$17
  Bottom 0.508: IC16.6 IC16.5
N$18
  Bottom 0.508: R7.P$2 16.51,100.33 17.78,101.6 IC10.2 17.78,105.41 15.24,107.95 11.43,107.95 10.16,109.22 R5.P$1 10.16,113.03 12.7,115.57 R8.P$2
N$19  (via drill 0.5)
  Top 0.508: IC17.6 83.82,72.39 87.63,68.58 v95.25,68.58 | v102.87,63.5 100.97,61.59 Q3.2
  Bottom 0.508: R24.P$1 83.82,77.47 IC17.6 | v95.25,68.58 100.33,68.58 102.87,66.04 v102.87,63.5
N$20
  Top 0.508: C3.2 40.64,115.57 43.18,118.11 52.07,118.11 54.61,115.57 54.61,107.95 TM6.P$1
  Bottom 0.508: IC12.2 31.75,105.41 34.29,107.95 36.83,107.95 39.37,110.49 39.37,113.03 36.83,115.57 C3.2 | POT1_EXT.2 59.69,107.95 TM6.P$1
N$21  (via drill 0.5)
  Top 0.508: v109.22,53.34 Q3.1
  Bottom 0.508: IC7.2 95.25,64.77 96.52,63.5 99.06,63.5 Q3.1 | R10.P$1 124.46,53.34 v109.22,53.34
N$22
  Bottom 0.508: 50.8,115.57 C4.2 | IC11.2 45.72,105.41 48.26,107.95 50.8,107.95 53.34,110.49 53.34,113.03 50.8,115.57 | 50.8,115.57 67.31,115.57 69.85,113.03 POT2_EXT.2 69.85,110.49 67.31,107.95 TM7.P$1
N$23
  Top 0.508: R19.P$2 R18.P$1
  Bottom 0.508: R18.P$1 118.11,63.5 124.46,63.5 125.73,64.77 IC6.3
N$24
  Bottom 0.508: R15.P$2 R14.P$1 48.26,63.5 54.61,63.5 55.88,64.77 IC1.3
N$25
  Top 0.508: TM5.P$1 82.55,110.49 POT3_EXT.2
  Bottom 0.508: IC10.3 20.32,103.89 21.72,102.49 24.51,102.49 26.67,100.33 R11.P$2 31.75,97.79 57.15,97.79 59.69,100.33 72.39,100.33 TM5.P$1
N$26
  Bottom 0.508: IC16.3 96.52,90.17 97.79,91.44 100.33,91.44 102.87,88.9 TM3.WIPER POT4_EXT.2
N$27
  Bottom 0.508: R24.P$2 76.2,77.47 76.2,71.12 77.47,69.85 78.74,69.85 81.28,67.31 IC17.2 81.28,62.23 82.55,60.96 | R29.P$1 82.55,60.96 | 82.55,60.96 R25.P$1
N$28
  Bottom 0.508: TM1.P$3 48.26,93.98 54.61,93.98 TM4.P$3 63.37,91.44 IC5.2 65.79,87.88 69.85,83.82 R1.P$2
N$29
  Bottom 1.8: U$14.R1 U$14.R2 107.57,16.51 U$5.+IN 125.15,34.09 U$7.2
N$30
  Bottom 0.508: R9.P$1 12.7,60.96 | 12.7,60.96 R28.P$1 | 12.7,60.96 11.43,62.23 IC9.2 11.43,67.31 8.89,69.85 7.62,69.85 6.35,71.12 6.35,77.47 R4.P$2
N$31
  Bottom 0.508: R23.P$1 R22.P$1 16.51,63.5 15.24,63.5 13.97,64.77 IC9.3
N$32
  Bottom 1.8: U$5.+OUT 94.11,25.27 100.33,19.05 100.33,8.89 102.87,6.35 U$15.L1 U$15.L2
N$33
  Bottom 1.8: U$10.- 31.75,15.24 29.21,17.78 21.59,17.78 19.05,15.24 U$11.2
PAUSE
  Bottom 0.406: PAUSE.2 66.29,31.5 58.42,39.37 U$4.A16
PLAY
  Bottom 0.406: PLAY.2 65.02,36.58 60.96,40.64 U$4.A15
POWER
  Bottom 0.406: U$4.A14 67.18,41.91 67.44,41.66 POWER.2
RECORD
  Bottom 0.406: REC.2 67.44,26.42 55.88,37.97 U$4.A17
SAWTOOTH
  Bottom 0.508: IC1.2 53.34,67.31 50.8,69.85 44.45,69.85 41.91,72.39 IC3.6 41.91,74.93 | 41.91,74.93 44.45,77.47 48.26,77.47 50.8,80.01 U$1.2 50.8,82.55 44.45,88.9 TM1.WIPER | 41.91,74.93 40.64,76.2 36.87,76.2 C1.2
SAWTOOTH2
  Top 0.508: IC16.2 93.98,86.36 101.6,78.74 C2.2
  Bottom 0.508: C2.2 106.68,76.24 106.68,76.2 110.49,76.2 111.76,74.93 | 111.76,74.93 IC14.6 111.76,72.39 114.3,69.85 120.65,69.85 123.19,67.31 IC6.2 | 111.76,74.93 114.3,77.47 118.11,77.47 120.65,80.01 U$3.2
SCL
  Top 0.508: U$12.SCL U$13.SCL 60.96,13.98 59.88,15.06 59.69,15.24 58.43,16.51 22.86,16.51 15.24,24.13 U$4.D3(CANTX)
SDA
  Top 0.508: U$12.SDA U$13.SDA 63.5,13.98 62.42,15.06 62.23,15.24 59.7,17.78 24.13,17.78 17.78,24.13 U$4.D4(CANRX)
SERVO1_PWM
  Top 0.508: U$4.D5 20.32,24.13 25.4,19.05 62.23,19.05 72.39,8.89 U$8.CONTROL
SERVO2_PWM
  Top 0.508: U$9.CONTROL 71.12,12.7 63.5,20.32 26.67,20.32 22.86,24.13 U$4.D6
SHUNT_ADC_POLL
  Top 0.508: U$9.GND 77.47,16.51 72.39,21.59 67.31,21.59 63.5,25.4 U$4.A13
  Bottom 1.8: U$9.GND U$8.GND 83.06,2.03 | 90.17,6.35 90.17,5.08 87.12,2.03 83.06,2.03 | 90.17,6.35 86.36,10.16 R30.P$2 | 90.17,6.35 93.98,10.16 R16.P$2 | R21.P$2 90.17,6.35 | U$11.3 16.51,7.62 22.1,2.03 83.06,2.03
SIGNAL1
  Top 0.508: IC9.6 13.97,72.39 11.43,69.85 7.62,69.85 5.08,67.31 5.08,53.34 6.35,52.07 26.67,52.07 31.11,56.52 Q1.2
  Bottom 0.508: IC9.6 13.97,77.47 R4.P$1
SQUARE
  Top 0.508: IC8.2 80.01,91.44 72.39,99.06 58.42,99.06 54.61,95.25 TM4.WIPER
  Bottom 0.508: IC8.2 80.01,91.44 82.55,93.98 IC8.6
V+  (via drill 0.6)
  Top 0.508: R2.P$2 62.23,55.88 R6.P$2 | R14.P$2 R6.P$2 | R6.P$2 67.31,71.12 IC4.7 67.31,78.74 | 106.68,76.2 IC14.7 111.76,71.12 115.57,71.12 118.11,73.66 IC6.8 123.19,71.12 128.27,71.12 130.81,68.58 130.81,64.77 R13.P$2 R18.P$2 | 106.68,76.2 106.68,80.01 105.41,81.28 TM3.P$1 107.95,93.98 | 107.95,93.98 93.98,93.98 IC16.8 90.17,97.79 90.17,101.6 87.63,104.14 R17.P$2 85.09,104.14 80.01,99.06 IC8.7 | 66.04,80.01 67.31,78.74 | 66.04,80.01 59.69,86.36 59.69,90.55 IC5.7 | 53.34,76.2 57.15,80.01 66.04,80.01 | 53.34,76.2 IC1.8 | 53.34,76.2 45.72,76.2 | 45.72,76.2 41.91,76.2 IC3.7 | 45.72,76.2 34.29,87.63 TM8.P$3 | 30.48,113.66 43.81,113.66 IC11.7 | 30.48,113.66 19.68,113.66 IC10.7 15.24,109.22 11.43,109.22 7.62,105.41 7.62,101.6 12.7,96.52 12.7,90.17 | 30.48,113.66 31.75,112.39 IC12.7 | 12.7,90.17 15.24,92.71 | 15.24,92.71 17.78,95.25 IC18.7 | 12.7,90.17 12.7,87.63 11.43,86.36 IC9.7 | 83.82,76.2 IC17.7 | 106.68,76.2 97.79,76.2 | 97.79,76.2 83.82,76.2 | IC7.7 97.79,76.2 | 15.24,92.71 22.86,92.71 | 22.86,92.71 25.4,90.17 IC2.7 | 83.82,76.2 78.74,81.28 76.2,81.28 v74.93,80.01 | 121.92,93.98 124.46,93.98 137.16,81.28 IC15.7 137.16,72.39 139.7,69.85 142.24,69.85 144.78,67.31 144.78,63.5 140.97,59.69 137.16,59.69 134.62,57.15 R10.P$2 134.62,39.09 U$7.6 | 121.92,93.98 107.95,93.98 | 121.92,93.98 IC13.7 | 67.31,78.74 v68.58,78.74 | v24.13,93.98 22.86,92.71
  Bottom 0.508: TM8.P$3 34.29,92.71 33.02,93.98 v24.13,93.98 | v74.93,80.01 73.66,78.74 v68.58,78.74 | POT4_EXT.3 TM3.P$1
V-
  Bottom 0.508: U$7.8 140.15,48.71 140.97,49.53
  pour Bottom: 2.54,120.65 2.54,48.26 146.05,48.26 146.05,98.81 97.79,98.81 97.79,120.65
VCC
  Bottom 1.8: CN1.PWR 131.18,16.51 U$14.L1 U$14.L2

### Text on the board
tPlace: filter control | master volume | M2 | Q control | Fs control | 50k | 3.5mm external / inverted output | 50k | 50k | 50k | M2 | mixer | duty cycle | adjust to 1.7V! | saw volume | square volume | 100k | 50k | 50k | 10k | M5 | GATE | GATE | ECE3872 Group 5 | Soohyun Kim | buttons | M3 | buck converter | Teensy 3.5 | + | + | 1.5-2A SLOW-BLOW | 9V in | MOTOR | MOSFET | SERVO2 | GATE | time-of-flight2 | 2A SLOW-BLOW | SERVO1 | 1ohm shunts | time-of-flight1
tNames: DPAN02E-15